# Altium schematic sheet EPS_5V_Buck-Converter.SchDoc: 5V / Buck-Converter
size A4
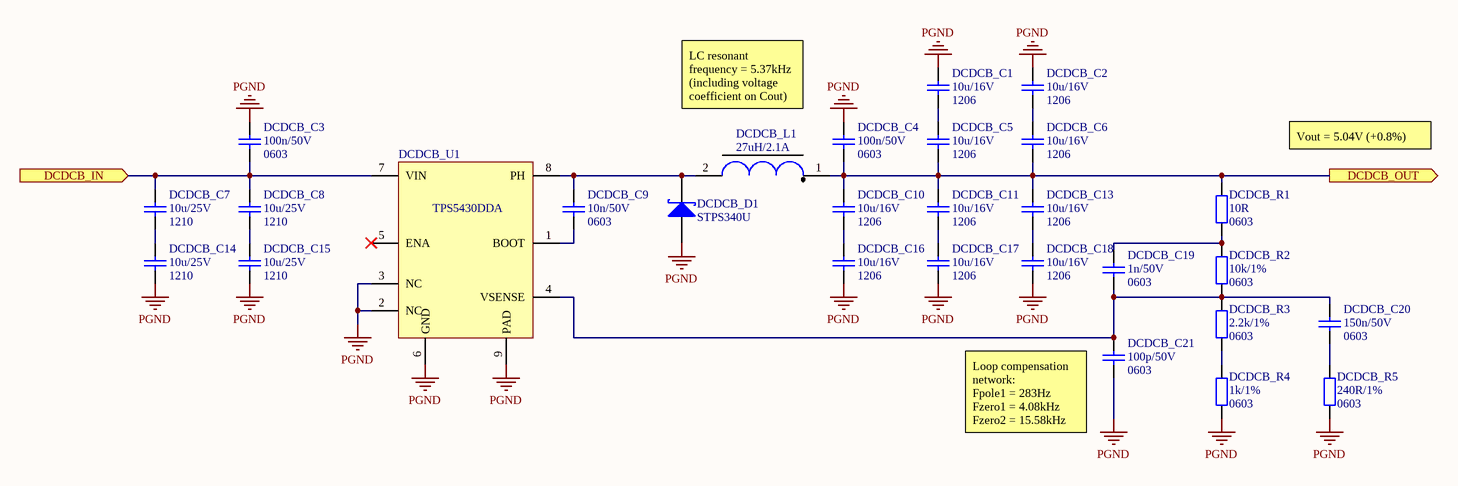
[diagram p0: EPS_5V_Buck-Converter.SchDoc]

## Parts
DCDCB_C1  Packge: 1206  [SMD_Capacitor_1206]  (hidden comment: 10u/16V)
DCDCB_C2  Packge: 1206  [SMD_Capacitor_1206]  (hidden comment: 10u/16V)
DCDCB_C3  Package: 0603  [SMD_Capacitor_0603]  (hidden comment: 100n/50V)
DCDCB_C4  Package: 0603  [SMD_Capacitor_0603]  (hidden comment: 100n/50V)
DCDCB_C5  Packge: 1206  [SMD_Capacitor_1206]  (hidden comment: 10u/16V)
DCDCB_C6  Packge: 1206  [SMD_Capacitor_1206]  (hidden comment: 10u/16V)
DCDCB_C7  Package: 1210  [SMD_Capacitor_1210]  (hidden comment: 10u/25V)
DCDCB_C8  Package: 1210  [SMD_Capacitor_1210]  (hidden comment: 10u/25V)
DCDCB_C9  value 10n/50V  Package: 0603  [SMD_Capacitor_0603]  (hidden comment: Cap)
DCDCB_C10  Packge: 1206  [SMD_Capacitor_1206]  (hidden comment: 10u/16V)
DCDCB_C11  Packge: 1206  [SMD_Capacitor_1206]  (hidden comment: 10u/16V)
DCDCB_C13  Packge: 1206  [SMD_Capacitor_1206]  (hidden comment: 10u/16V)
DCDCB_C14  Package: 1210  [SMD_Capacitor_1210]  (hidden comment: 10u/25V)
DCDCB_C15  Package: 1210  [SMD_Capacitor_1210]  (hidden comment: 10u/25V)
DCDCB_C16  Packge: 1206  [SMD_Capacitor_1206]  (hidden comment: 10u/16V)
DCDCB_C17  Packge: 1206  [SMD_Capacitor_1206]  (hidden comment: 10u/16V)
DCDCB_C18  Packge: 1206  [SMD_Capacitor_1206]  (hidden comment: 10u/16V)
DCDCB_C19  value 1n/50V  Package: 0603  [SMD_Capacitor_0603]  (hidden comment: Cap)
DCDCB_C20  Package: 0603  [SMD_Capacitor_0603]  (hidden comment: 150n/50V)
DCDCB_C21  value 100p/50V  Package: 0603  [SMD_Capacitor_0603]  (hidden comment: Cap)
DCDCB_D1  STPS340U  [DO-214AA]
DCDCB_L1  27uH/2.1A  [Coilcraft_MSS1260]
DCDCB_R1  Package: 0603  [SMD_Resistor_0603]  (hidden comment: 10R)
DCDCB_R2  Package: 0603  [SMD_Resistor_0603]  (hidden comment: 10k/1%)
DCDCB_R3  Package: 0603  [SMD_Resistor_0603]  (hidden comment: 2.2k/1%)
DCDCB_R4  Package: 0603  [SMD_Resistor_0603]  (hidden comment: 1k/1%)
DCDCB_R5  Package: 0603  [SMD_Resistor_0603]  (hidden comment: 240R/1%)
DCDCB_U1  TPS5430DDA  [DDA-9]

## Ports
DCDCB_IN (in), DCDCB_OUT (out)

## Nets
PGND: DCDCB_C1.1 DCDCB_C2.1 DCDCB_C3.2 DCDCB_C4.2 DCDCB_C14.2 DCDCB_C15.2 DCDCB_C16.2 DCDCB_C17.2 DCDCB_C18.2 DCDCB_C21.2 DCDCB_D1.A DCDCB_R4.1 DCDCB_R5.1 DCDCB_U1.2(NC) DCDCB_U1.3(NC) DCDCB_U1.6(GND) DCDCB_U1.9(PAD)
DCDCB_IN: DCDCB_C3.1 DCDCB_C7.1 DCDCB_C8.1 DCDCB_U1.7(VIN) ; port DCDCB_IN
DCDCB_OUT: DCDCB_C4.1 DCDCB_C5.2 DCDCB_C6.2 DCDCB_C10.1 DCDCB_C11.1 DCDCB_C13.1 DCDCB_L1.1 DCDCB_R1.2 ; port DCDCB_OUT
NetDCDCB_C1_2: DCDCB_C1.2 DCDCB_C5.1
NetDCDCB_C2_2: DCDCB_C2.2 DCDCB_C6.1
NetDCDCB_C7_2: DCDCB_C7.2 DCDCB_C14.1
NetDCDCB_C8_2: DCDCB_C8.2 DCDCB_C15.1
NetDCDCB_C9_1: DCDCB_C9.1 DCDCB_D1.K DCDCB_L1.2 DCDCB_U1.8(PH)
NetDCDCB_C9_2: DCDCB_C9.2 DCDCB_U1.1(BOOT)
NetDCDCB_C10_2: DCDCB_C10.2 DCDCB_C16.1
NetDCDCB_C11_2: DCDCB_C11.2 DCDCB_C17.1
NetDCDCB_C13_2: DCDCB_C13.2 DCDCB_C18.1
NetDCDCB_C19_1: DCDCB_C19.1 DCDCB_R1.1 DCDCB_R2.2
NetDCDCB_C19_2: DCDCB_C19.2 DCDCB_C20.1 DCDCB_C21.1 DCDCB_R2.1 DCDCB_R3.2 DCDCB_U1.4(VSENSE)
NetDCDCB_C20_2: DCDCB_C20.2 DCDCB_R5.2
NetDCDCB_R3_1: DCDCB_R3.1 DCDCB_R4.2

Not connected (* = marked no-connect by the designer): DCDCB_U1 5(ENA)*

## Notes on the sheet
- LC resonant frequency = 5.37kHz (including voltage coefficient on Cout)
- Vout = 5.04V (+0.8%)
- (near DCDCB_C21) Loop compensation network:
  Fpole1 = 283Hz
  Fzero1 = 4.08kHz
  Fzero2 = 15.58kHz
- Title:
- Project:
- Author:
- Model:
- Document Number:
- Checked by:
- Rev:
- Date:
- Approved by:
- Sheet:
- of
- File name:

## Library data of the parts
DCDCB_C1 DCDCB_C2 DCDCB_C5 DCDCB_C6 DCDCB_C10 DCDCB_C11 DCDCB_C13 DCDCB_C16-DCDCB_C18 = Cer_C1206T106K4RACTU: Ceramic Cap Kemet COTS 10u/16V X7R 1206; ManufacturerPartNumber: C1206T106K4RACTU; Manufacturer: Kemet; Value: 10u/16V
DCDCB_C3 DCDCB_C4 = Cer_GCJ188R71H104KA12D: Ceramic Cap Murata Automotive 100n/50V X7R 0603; Manufacturer: Murata; ManufacturerPartNumber: GCJ188R71H104KA12D; Value: 100n/50V
DCDCB_C7 DCDCB_C8 DCDCB_C14 DCDCB_C15 = Cer_GCJ32ER71E106KA12L: Ceramic Cap Murata Automotive 10u/25V X7R 1210; Manufacturer: Murata; ManufacturerPartNumber: GCJ32ER71E106KA12L; Value: 10u/25V
DCDCB_C20 = Cer_GCM188R71H154KA64D: Ceramic Cap Murata Automotive 150n/50V X7R 0603; Manufacturer: Murata; ManufacturerPartNumber: GCM188R71H154KA64D; Value: 150n/50V
DCDCB_D1 = STPS340x: 3A/40V Power Schottky Rectifier.; Manufacturer: STMicroelectronics; Value: STPS340U
DCDCB_L1 = MSS1260-273MLx: Coilcraft MSS1260 Inductor, L=27uH, Irise20deg=2.1A, ESR=50mR, SRF=13MHz.; Manufacturer: Coilcraft; ManufacturerPartNumber: MSS1260-273MLx; Value: 27uH/2.1A
DCDCB_R1-DCDCB_R5 = Res
  DCDCB_R1: Value: 10R
  DCDCB_R2: Value: 10k/1%
  DCDCB_R3: Value: 2.2k/1%
  DCDCB_R4: Value: 1k/1%
  DCDCB_R5: Value: 240R/1%
DCDCB_U1 = TPS5430: TPS5430 3-A, Wide Input Range, Step-Down Converter; Manufacturer: Texas Instruments; Value: TPS5430DDA